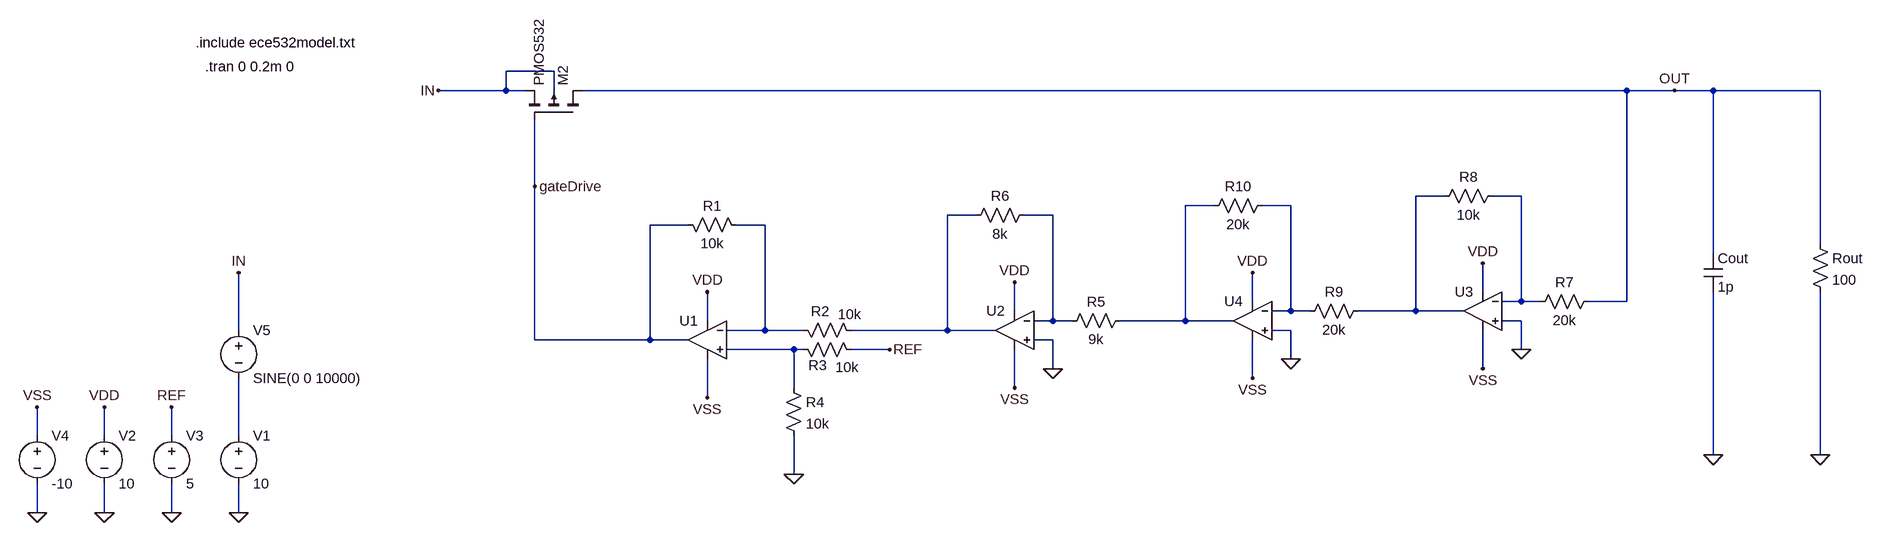
[diagram p0: schematic LDO_v1_naive_feedback.asc]
LDO_v1_naive_feedback.asc, the LTspice schematic file:
Version 4
SHEET 1 3668 1220
WIRE -272 64 -352 64
WIRE -352 96 -352 64
WIRE -352 96 -656 96
WIRE -320 96 -352 96
WIRE -272 96 -272 64
WIRE 1520 96 -224 96
WIRE 1600 96 1520 96
WIRE 1664 96 1600 96
WIRE 1856 96 1664 96
WIRE -304 256 -304 144
WIRE 1216 272 1168 272
WIRE 1344 272 1296 272
WIRE 832 288 784 288
WIRE 960 288 912 288
WIRE 432 304 384 304
WIRE 560 304 512 304
WIRE -48 320 -112 320
WIRE 80 320 32 320
WIRE 1856 352 1856 96
WIRE 1664 368 1664 96
WIRE 1280 432 1280 384
WIRE 896 448 896 400
WIRE 1344 448 1344 272
WIRE 1344 448 1312 448
WIRE 1376 448 1344 448
WIRE 1520 448 1520 96
WIRE 1520 448 1456 448
WIRE 496 464 496 416
WIRE 960 464 960 288
WIRE 960 464 928 464
WIRE 992 464 960 464
WIRE 1168 464 1168 272
WIRE 1168 464 1072 464
WIRE 1248 464 1168 464
WIRE -16 480 -16 432
WIRE 560 480 560 304
WIRE 560 480 528 480
WIRE 592 480 560 480
WIRE 784 480 784 288
WIRE 784 480 672 480
WIRE 864 480 784 480
WIRE 1344 480 1312 480
WIRE -1104 496 -1104 400
WIRE 80 496 80 320
WIRE 80 496 16 496
WIRE 144 496 80 496
WIRE 384 496 384 304
WIRE 384 496 224 496
WIRE 464 496 384 496
WIRE 960 496 928 496
WIRE -304 512 -304 256
WIRE -112 512 -112 320
WIRE -112 512 -304 512
WIRE -48 512 -112 512
WIRE 560 512 528 512
WIRE 128 528 16 528
WIRE 144 528 128 528
WIRE 288 528 224 528
WIRE 1344 528 1344 480
WIRE 960 544 960 496
WIRE 560 560 560 512
WIRE 1280 560 1280 496
WIRE 896 576 896 512
WIRE 128 592 128 528
WIRE 496 592 496 528
WIRE -16 608 -16 544
WIRE -1440 672 -1440 624
WIRE -1328 672 -1328 624
WIRE -1216 672 -1216 624
WIRE -1104 672 -1104 576
WIRE 1664 704 1664 432
WIRE 1856 704 1856 432
WIRE 128 736 128 672
WIRE -1440 800 -1440 752
WIRE -1328 800 -1328 752
WIRE -1216 800 -1216 752
WIRE -1104 800 -1104 752
FLAG 1664 704 0
FLAG -1328 800 0
FLAG -1328 624 VDD
FLAG 1856 704 0
FLAG -304 256 gateDrive
FLAG -1216 800 0
FLAG 128 736 0
FLAG -16 432 VDD
FLAG -16 608 VSS
FLAG 496 416 VDD
FLAG 496 592 VSS
FLAG 560 560 0
FLAG 288 528 REF
FLAG 1280 384 VDD
FLAG 1280 560 VSS
FLAG 1344 528 0
FLAG 896 400 VDD
FLAG 896 576 VSS
FLAG 960 544 0
FLAG 1600 96 OUT
FLAG -1216 624 REF
FLAG -1440 800 0
FLAG -1440 624 VSS
FLAG -1104 800 0
FLAG -1104 400 IN
FLAG -656 96 IN
SYMBOL cap 1648 368 R0
SYMATTR InstName Cout
SYMATTR Value 1p
SYMBOL voltage -1328 656 R0
WINDOW 123 0 0 Left 2
WINDOW 39 0 0 Left 2
SYMATTR InstName V2
SYMATTR Value 10
SYMBOL res 1840 336 R0
SYMATTR InstName Rout
SYMATTR Value 100
SYMBOL voltage -1216 656 R0
WINDOW 123 0 0 Left 2
WINDOW 39 0 0 Left 2
SYMATTR InstName V3
SYMATTR Value 5
SYMBOL res -64 304 M90
WINDOW 0 0 56 VBottom 2
WINDOW 3 32 56 VTop 2
SYMATTR InstName R1
SYMATTR Value 10k
SYMBOL res 128 480 M90
WINDOW 0 0 44 VBottom 2
WINDOW 3 -26 93 VTop 2
SYMATTR InstName R2
SYMATTR Value 10k
SYMBOL res 128 512 M90
WINDOW 0 58 40 VBottom 2
WINDOW 3 30 89 VTop 2
SYMATTR InstName R3
SYMATTR Value 10k
SYMBOL res 112 576 R0
SYMATTR InstName R4
SYMATTR Value 10k
SYMBOL Opamps\\UniversalOpamp2 -16 512 M0
SYMATTR InstName U1
SYMBOL Opamps\\UniversalOpamp2 496 496 M0
SYMATTR InstName U2
SYMBOL res 576 496 R270
WINDOW 0 32 56 VTop 2
WINDOW 3 0 56 VBottom 2
SYMATTR InstName R5
SYMATTR Value 9k
SYMBOL res 416 320 R270
WINDOW 0 32 56 VTop 2
WINDOW 3 0 56 VBottom 2
SYMATTR InstName R6
SYMATTR Value 8k
SYMBOL Opamps\\UniversalOpamp2 1280 464 M0
SYMATTR InstName U3
SYMBOL res 1360 464 R270
WINDOW 0 32 56 VTop 2
WINDOW 3 0 56 VBottom 2
SYMATTR InstName R7
SYMATTR Value 20k
SYMBOL res 1200 288 R270
WINDOW 0 32 56 VTop 2
WINDOW 3 0 56 VBottom 2
SYMATTR InstName R8
SYMATTR Value 10k
SYMBOL Opamps\\UniversalOpamp2 896 480 M0
SYMATTR InstName U4
SYMBOL res 976 480 R270
WINDOW 0 32 56 VTop 2
WINDOW 3 0 56 VBottom 2
SYMATTR InstName R9
SYMATTR Value 20k
SYMBOL res 816 304 R270
WINDOW 0 32 56 VTop 2
WINDOW 3 0 56 VBottom 2
SYMATTR InstName R10
SYMATTR Value 20k
SYMBOL voltage -1440 656 R0
WINDOW 123 0 0 Left 2
WINDOW 39 0 0 Left 2
SYMATTR InstName V4
SYMATTR Value -10
SYMBOL pmos4 -224 144 M270
SYMATTR InstName M2
SYMATTR Value PMOS532
SYMATTR Value2 l=1u w=1000u m=1
SYMBOL voltage -1104 656 R0
WINDOW 123 0 0 Left 2
WINDOW 39 0 0 Left 2
SYMATTR InstName V1
SYMATTR Value 10
SYMBOL voltage -1104 480 R0
WINDOW 123 0 0 Left 2
WINDOW 39 0 0 Left 2
SYMATTR InstName V5
SYMATTR Value SINE(0 0 10000)
TEXT -1176 16 Left 2 !.include ece532model.txt
TEXT -1160 56 Left 2 !.tran 0 0.2m 0

The netlist it stands for:
* LDO_v1_naive_feedback.asc
Cout OUT 0 1p
V2 VDD 0 10
Rout OUT 0 100
V3 REF 0 5
R1 gateDrive N007 10k
R2 N007 N005 10k
R3 N008 REF 10k
R4 N008 0 10k
XU1 N008 N007 VDD VSS gateDrive level.2 Avol=1Meg GBW=10Meg Slew=10Meg ilimit=25m rail=0 Vos=0 phimargin=45 en=0 enk=0 in=0 ink=0 Rin=500Meg  ; pins IN+ IN- V+ V- OUT
XU2 0 N006 VDD VSS N005 level.2 Avol=1Meg GBW=10Meg Slew=10Meg ilimit=25m rail=0 Vos=0 phimargin=45 en=0 enk=0 in=0 ink=0 Rin=500Meg  ; pins IN+ IN- V+ V- OUT
R5 N006 N003 9k
R6 N005 N006 8k
XU3 0 N002 VDD VSS N001 level.2 Avol=1Meg GBW=10Meg Slew=10Meg ilimit=25m rail=0 Vos=0 phimargin=45 en=0 enk=0 in=0 ink=0 Rin=500Meg  ; pins IN+ IN- V+ V- OUT
R7 N002 OUT 20k
R8 N001 N002 10k
XU4 0 N004 VDD VSS N003 level.2 Avol=1Meg GBW=10Meg Slew=10Meg ilimit=25m rail=0 Vos=0 phimargin=45 en=0 enk=0 in=0 ink=0 Rin=500Meg  ; pins IN+ IN- V+ V- OUT
R9 N004 N001 20k
R10 N003 N004 20k
V4 VSS 0 -10
M2 OUT gateDrive IN IN PMOS532 l=1u w=1000u m=1
V1 N009 0 10
V5 IN N009 SINE(0 0 10000)
.model NMOS NMOS
.model PMOS PMOS
.lib standard.mos
.include ece532model.txt
.tran 0 0.2m 0
.lib UniversalOpamps2.sub
.backanno
.end